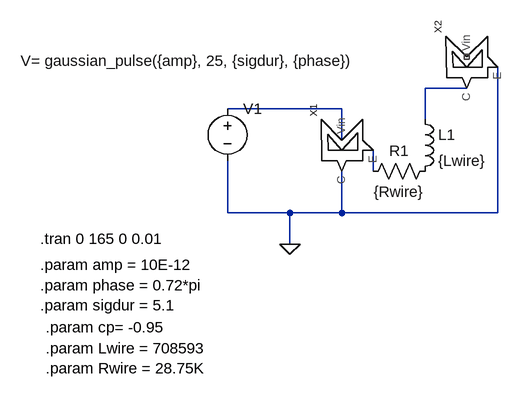
[diagram p0: schematic memcell_w_nanantennas.asc]
memcell_w_nanantennas.asc, the LTspice schematic file:
Version 4
SHEET 1 1016 680
WIRE 768 -16 704 -16
WIRE 576 16 400 16
WIRE 704 32 704 -16
WIRE 576 64 576 16
WIRE 624 112 624 80
WIRE 400 176 400 96
WIRE 496 176 400 176
WIRE 576 176 576 112
WIRE 576 176 496 176
WIRE 816 176 816 -48
WIRE 816 176 576 176
WIRE 496 224 496 176
FLAG 496 224 0
SYMBOL nanoantenna_component 576 64 R270
SYMATTR InstName X1
SYMBOL voltage 400 0 R0
WINDOW 3 -318 -58 Left 2
WINDOW 123 0 0 Left 0
WINDOW 39 0 0 Left 0
SYMATTR InstName V1
SYMATTR Value V= gaussian_pulse({amp}, 25, {sigdur}, {phase})
SYMBOL nanoantenna_component 768 -64 R270
SYMATTR InstName X2
SYMBOL res 720 96 R90
WINDOW 0 0 56 VBottom 2
WINDOW 3 32 56 VTop 2
SYMATTR InstName R1
SYMATTR Value {Rwire}
SYMBOL ind 688 16 R0
SYMATTR InstName L1
SYMATTR Value {Lwire}
TEXT 112 256 Left 2 !.param amp = 10E-12\n.param phase = 0.72*pi\n.param sigdur = 5.1
TEXT 112 216 Left 2 !.tran 0 165 0 0.01
TEXT 120 352 Left 2 !.param cp= -0.95
TEXT 120 384 Left 2 !.param Lwire = 708593\n.param Rwire = 28.75K

The netlist it stands for:
* memcell_w_nanantennas.asc
XX1 N002 N003 0 nanoantenna_component params: nanoantenna_component  ; pins Vin E C
V1 N002 0 V= gaussian_pulse({amp}, 25, {sigdur}, {phase})
XX2 NC_01 0 N001 nanoantenna_component params: nanoantenna_component  ; pins Vin E C
R1 P001 N003 {Rwire}
L1 N001 P001 {Lwire}
.param amp = 10E-12
.param phase = 0.72*pi
.param sigdur = 5.1
.tran 0 165 0 0.01
.param cp= -0.95
.param Lwire = 708593
.param Rwire = 28.75K
.backanno
.end